# Altium schematic sheet GEM_AFE_128.SchDoc: Top
size 420 x 297 mm; CheckedBy: K.Belewicz; DrawnBy: G.Kasprowicz; SheetNumber: 1; SheetTotal: 5; ModifiedBy: -; CheckedDate: 12.06.2022; DivGrp: WUT ISE; Designer: G.Kasprowicz
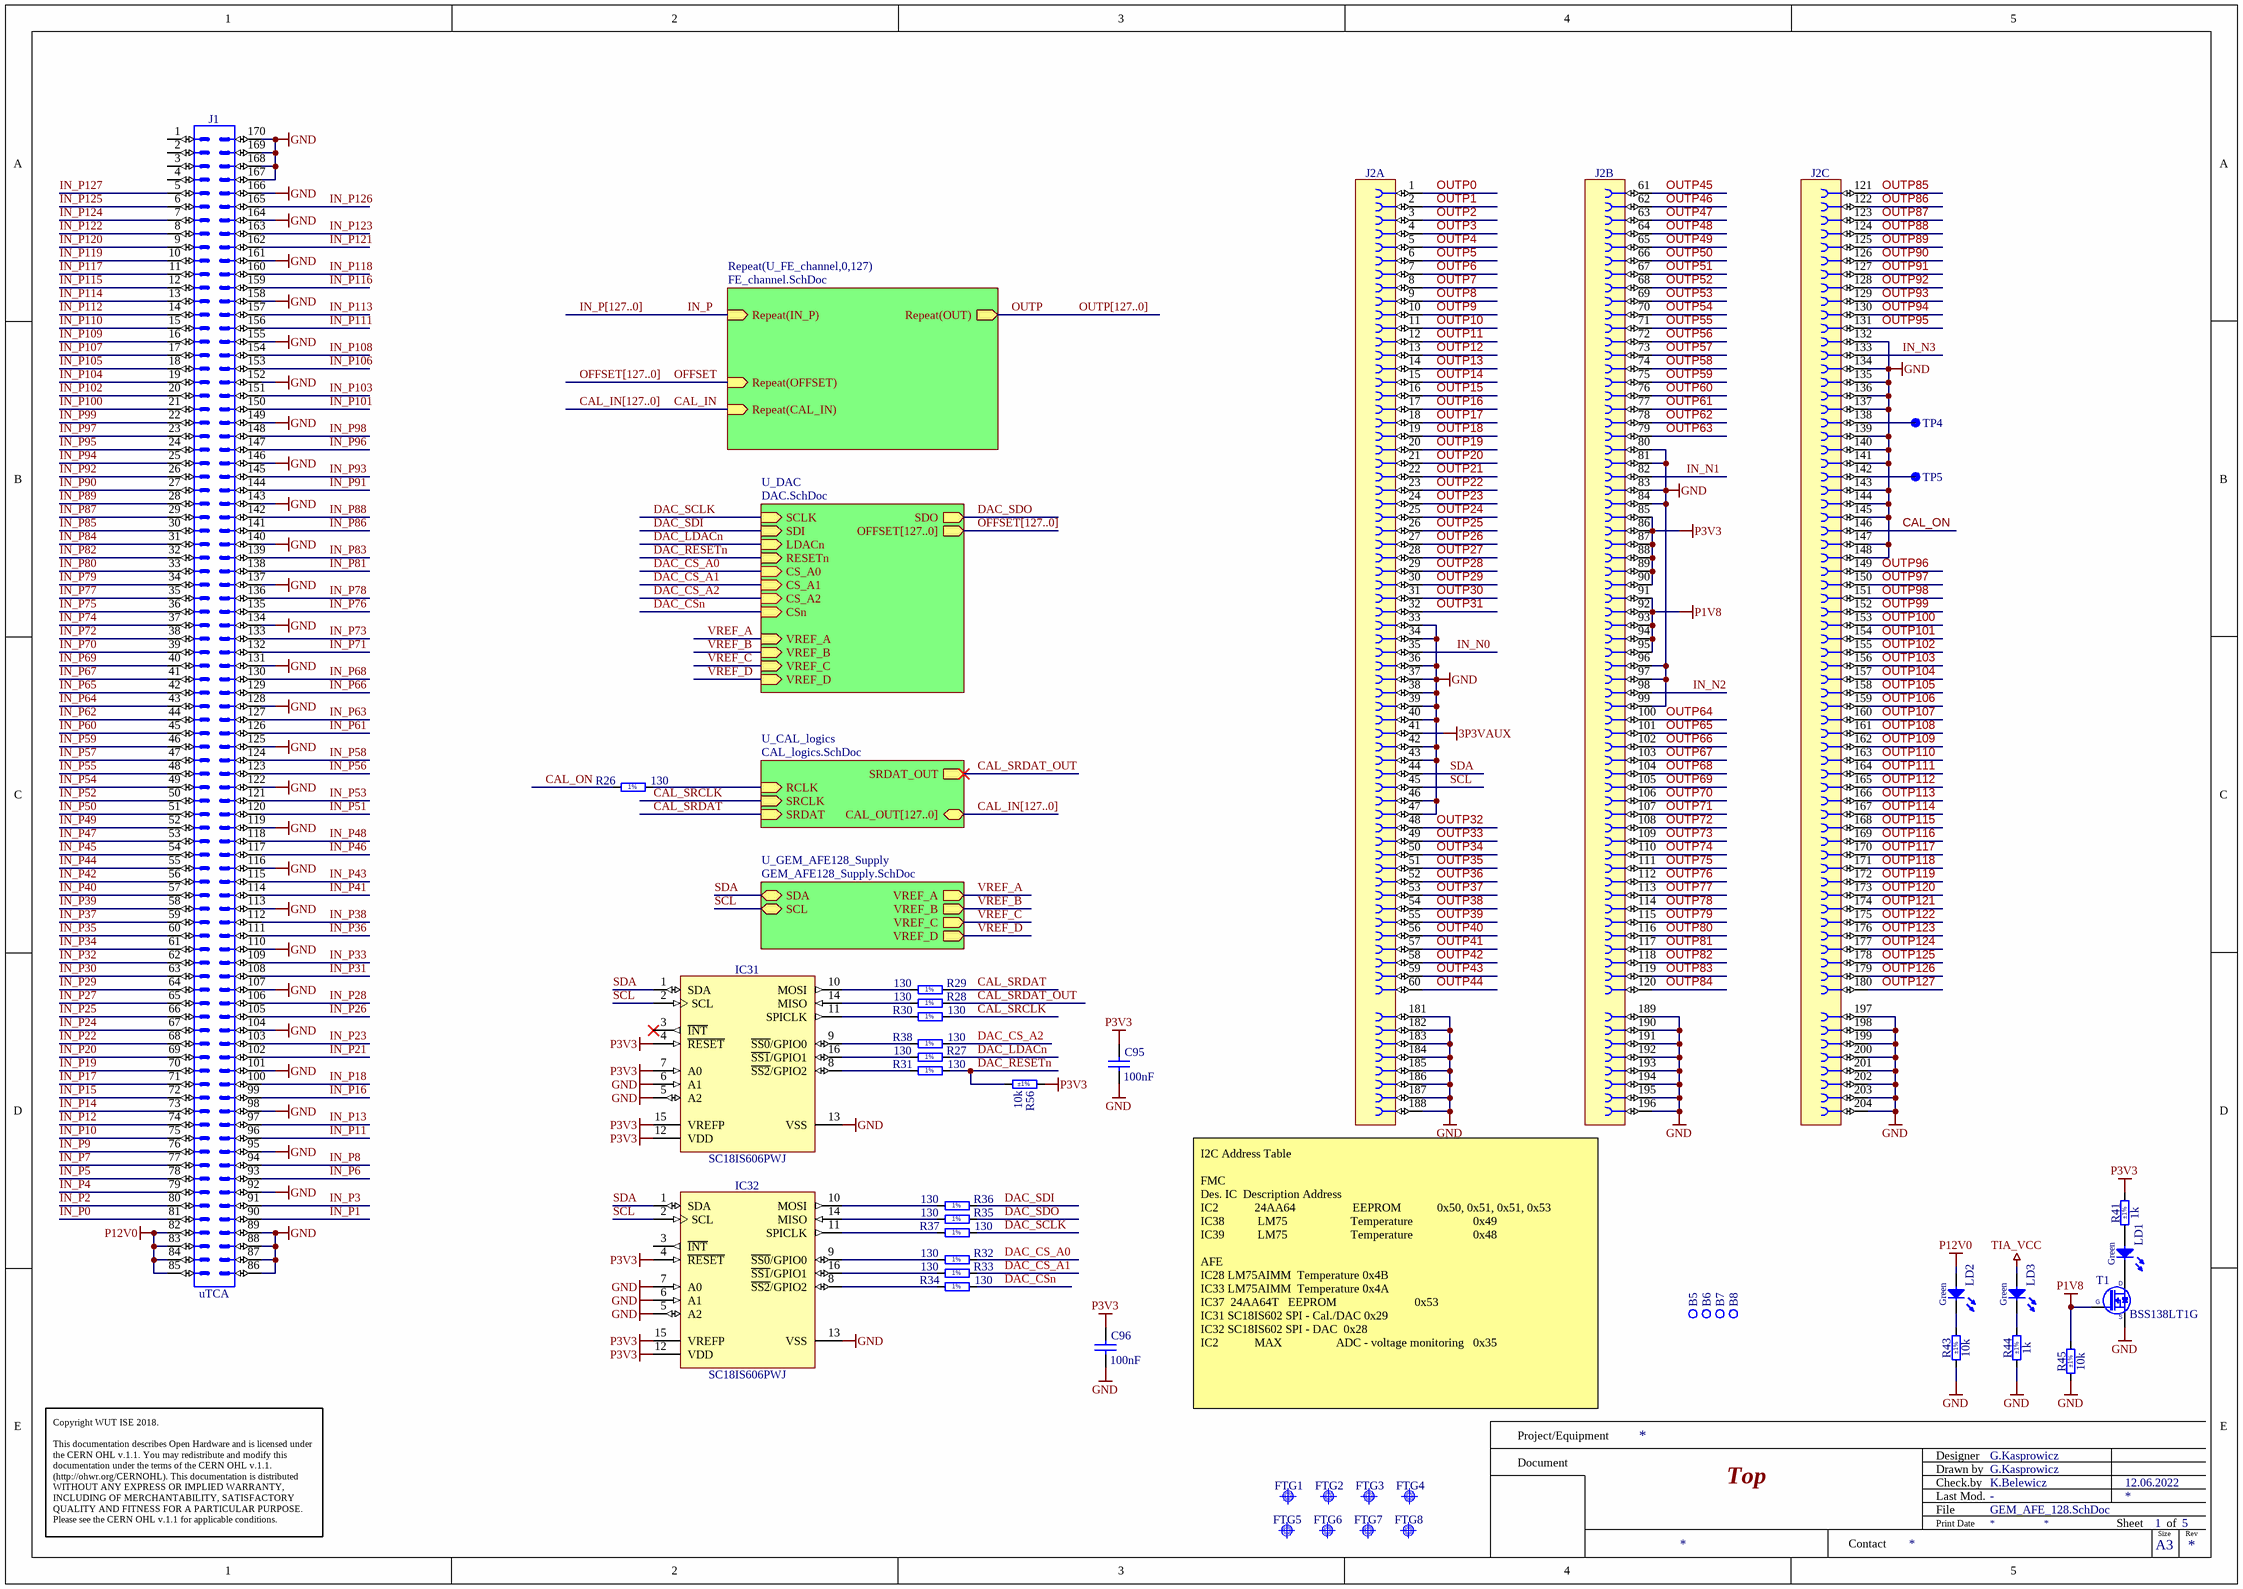
[diagram p0: GEM_AFE_128.SchDoc]

## Parts
B5  Plated Hole  [MTG320_550]  (value not drawn)  (no BOM)
B6  Plated Hole  [MTG320_550]  (value not drawn)  (no BOM)
B7  Plated Hole  [MTG320_550]  (value not drawn)  (no BOM)
B8  Plated Hole  [MTG320_550]  (value not drawn)  (no BOM)
C95  100nF  [CAPC1005X55N]
C96  100nF  [CAPC1005X55N]
FTG1  Use only in PCB  [FIDUCIAL_TOP_C100-200]  (value not drawn)
FTG2  Use only in PCB  [FIDUCIAL_TOP_C100-200]  (value not drawn)
FTG3  Use only in PCB  [FIDUCIAL_TOP_C100-200]  (value not drawn)
FTG4  Use only in PCB  [FIDUCIAL_TOP_C100-200]  (value not drawn)
FTG5  Use only in PCB  [FIDUCIAL_TOP_S100-200]  (value not drawn)
FTG6  Use only in PCB  [FIDUCIAL_TOP_S100-200]  (value not drawn)
FTG7  Use only in PCB  [FIDUCIAL_TOP_S100-200]  (value not drawn)
FTG8  Use only in PCB  [FIDUCIAL_TOP_S100-200]  (value not drawn)
IC31  SC18IS606PWJ  [SOP65P640X110-16N]
IC32  SC18IS606PWJ  [SOP65P640X110-16N]
J1  uTCA  [MICRO-TCA]
J2  (no value)  [SAMTEC_QSH-090-01-F-D-RA]  (parts A,B,C of 3)
LD1  Green  [LED_KINGBRIGHT_KPA-1606CGCK]
LD2  Green  [LED_KINGBRIGHT_KPA-1606CGCK]
LD3  Green  [LED_KINGBRIGHT_KPA-1606CGCK]
R26  130  [RESC1005X40N]
R27  130  [RESC1005X40N]
R28  130  [RESC1005X40N]
R29  130  [RESC1005X40N]
R30  130  [RESC1005X40N]
R31  130  [RESC1005X40N]
R32  130  [RESC1005X40N]
R33  130  [RESC1005X40N]
R34  130  [RESC1005X40N]
R35  130  [RESC1005X40N]
R36  130  [RESC1005X40N]
R37  130  [RESC1005X40N]
R38  130  [RESC1005X40N]
R41  1k  Tolerance: ±1%  [RESC1005X40N]
R43  10k  Tolerance: ±1%  [RESC1005X40N]
R44  1k  Tolerance: ±1%  [RESC1005X40N]
R45  10k  Tolerance: ±1%  [RESC1005X40N]
R56  10k  Tolerance: ±1%  [RESC1005X40N]
T1  BSS138LT1G  [SOT95P240X110-3N]
TP4  SMD Pad  [C100]  (value not drawn)
TP5  SMD Pad  [C100]  (value not drawn)

## Sub-sheets
Repeat(U_FE_channel,0,127) = FE_channel.SchDoc: Repeat(IN_P) (in), Repeat(OUT) (out), Repeat(CAL_IN) (in), Repeat(OFFSET) (in)
U_CAL_logics = CAL_logics.SchDoc: RCLK (in), SRCLK (in), SRDAT (in), SRDAT_OUT (out), CAL_OUT[127..0] (bidir)
U_DAC = DAC.SchDoc: SCLK (in), SDI (in), SDO (out), LDACn (in), RESETn (in), CS_A0 (in), CS_A1 (in), CS_A2 (in), CSn (in), OFFSET[127..0] (out), VREF_A (in), VREF_B (in), VREF_C (in), VREF_D (in)
U_GEM_AFE128_Supply = GEM_AFE128_Supply.SchDoc: SDA (bidir), SCL (bidir), VREF_A (out), VREF_B (out), VREF_C (out), VREF_D (out)

## Nets
3P3VAUX: J2.41
GND: C95.1 C96.1 IC31.5(A2) IC31.6(A1) IC31.13(VSS) IC32.5(A2) IC32.6(A1) IC32.7(A0) IC32.13(VSS) J1.86 J1.87 J1.88 J1.89 J1.92 J1.95 J1.98 J1.101 J1.104 J1.107 J1.110 J1.113 J1.116 J1.119 J1.122 J1.125 J1.128 J1.131 J1.134 J1.137 J1.140 J1.143 J1.146 J1.149 J1.152 J1.155 J1.158 J1.161 J1.164 J1.166 J1.167 J1.168 J1.169 J1.170 J2.33 J2.34 J2.36 J2.37 J2.38 J2.39 J2.40 J2.42 J2.43 J2.46 J2.47 J2.80 J2.81 J2.83 J2.84 J2.96 J2.97 J2.99 J2.132 J2.134 J2.135 J2.136 J2.137 J2.139 J2.140 J2.141 J2.143 J2.144 J2.145 J2.147 J2.148 J2.181 J2.182 J2.183 J2.184 J2.185 J2.186 J2.187 J2.188 J2.189 J2.190 J2.191 J2.192 J2.193 J2.194 J2.195 J2.196 J2.197 J2.198 J2.199 J2.200 J2.201 J2.202 J2.203 J2.204 R43.1 R44.1 R45.1 T1.2(S)
P1V8: J2.91 J2.92 J2.93 J2.94 J2.95 R45.2 T1.1(G)
P3V3: C95.2 C96.2 IC31.4(~{RESET}) IC31.7(A0) IC31.12(VDD) IC31.15(VREFP) IC32.4(~{RESET}) IC32.12(VDD) IC32.15(VREFP) J2.85 J2.86 J2.87 J2.88 J2.89 J2.90 R41.2 R56.2
P12V0: J1.82 J1.83 J1.84 J1.85 LD2.2(A)
TIA_VCC: LD3.2(A)
CAL_IN: sheet Repeat(U_FE_channel,0,127)/Repeat(CAL_IN)
CAL_ON: J2.146 R26.1
CAL_SRCLK: R30.2 ; sheet U_CAL_logics/SRCLK
CAL_SRDAT: R29.1 ; sheet U_CAL_logics/SRDAT
CAL_SRDAT_OUT: R28.1 ; sheet U_CAL_logics/SRDAT_OUT
DAC_CS_A0: R32.1 ; sheet U_DAC/CS_A0
DAC_CS_A1: R33.1 ; sheet U_DAC/CS_A1
DAC_CS_A2: R38.2 ; sheet U_DAC/CS_A2
DAC_CSn: R34.2 ; sheet U_DAC/CSn
DAC_LDACn: R27.1 ; sheet U_DAC/LDACn
DAC_RESETn: R31.2 R56.1 ; sheet U_DAC/RESETn
DAC_SCLK: R37.2 ; sheet U_DAC/SCLK
DAC_SDI: R36.1 ; sheet U_DAC/SDI
DAC_SDO: R35.1 ; sheet U_DAC/SDO
IN_N0: J2.35
IN_N1: J2.82
IN_N2: J2.98
IN_N3: J2.133
IN_P: sheet Repeat(U_FE_channel,0,127)/Repeat(IN_P)
IN_P0: J1.81
IN_P1: J1.90
IN_P2: J1.80
IN_P3: J1.91
IN_P4: J1.79
IN_P5: J1.78
IN_P6: J1.93
IN_P7: J1.77
IN_P8: J1.94
IN_P9: J1.76
IN_P10: J1.75
IN_P11: J1.96
IN_P12: J1.74
IN_P13: J1.97
IN_P14: J1.73
IN_P15: J1.72
IN_P16: J1.99
IN_P17: J1.71
IN_P18: J1.100
IN_P19: J1.70
IN_P20: J1.69
IN_P21: J1.102
IN_P22: J1.68
IN_P23: J1.103
IN_P24: J1.67
IN_P25: J1.66
IN_P26: J1.105
IN_P27: J1.65
IN_P28: J1.106
IN_P29: J1.64
IN_P30: J1.63
IN_P31: J1.108
IN_P32: J1.62
IN_P33: J1.109
IN_P34: J1.61
IN_P35: J1.60
IN_P36: J1.111
IN_P37: J1.59
IN_P38: J1.112
IN_P39: J1.58
IN_P40: J1.57
IN_P41: J1.114
IN_P42: J1.56
IN_P43: J1.115
IN_P44: J1.55
IN_P45: J1.54
IN_P46: J1.117
IN_P47: J1.53
IN_P48: J1.118
IN_P49: J1.52
IN_P50: J1.51
IN_P51: J1.120
IN_P52: J1.50
IN_P53: J1.121
IN_P54: J1.49
IN_P55: J1.48
IN_P56: J1.123
IN_P57: J1.47
IN_P58: J1.124
IN_P59: J1.46
IN_P60: J1.45
IN_P61: J1.126
IN_P62: J1.44
IN_P63: J1.127
IN_P64: J1.43
IN_P65: J1.42
IN_P66: J1.129
IN_P67: J1.41
IN_P68: J1.130
IN_P69: J1.40
IN_P70: J1.39
IN_P71: J1.132
IN_P72: J1.38
IN_P73: J1.133
IN_P74: J1.37
IN_P75: J1.36
IN_P76: J1.135
IN_P77: J1.35
IN_P78: J1.136
IN_P79: J1.34
IN_P80: J1.33
IN_P81: J1.138
IN_P82: J1.32
IN_P83: J1.139
IN_P84: J1.31
IN_P85: J1.30
IN_P86: J1.141
IN_P87: J1.29
IN_P88: J1.142
IN_P89: J1.28
IN_P90: J1.27
IN_P91: J1.144
IN_P92: J1.26
IN_P93: J1.145
IN_P94: J1.25
IN_P95: J1.24
IN_P96: J1.147
IN_P97: J1.23
IN_P98: J1.148
IN_P99: J1.22
IN_P100: J1.21
IN_P101: J1.150
IN_P102: J1.20
IN_P103: J1.151
IN_P104: J1.19
IN_P105: J1.18
IN_P106: J1.153
IN_P107: J1.17
IN_P108: J1.154
IN_P109: J1.16
IN_P110: J1.15
IN_P111: J1.156
IN_P112: J1.14
IN_P113: J1.157
IN_P114: J1.13
IN_P115: J1.12
IN_P116: J1.159
IN_P117: J1.11
IN_P118: J1.160
IN_P119: J1.10
IN_P120: J1.9
IN_P121: J1.162
IN_P122: J1.8
IN_P123: J1.163
IN_P124: J1.7
IN_P125: J1.6
IN_P126: J1.165
IN_P127: J1.5
OFFSET: sheet Repeat(U_FE_channel,0,127)/Repeat(OFFSET)
OUTP: sheet Repeat(U_FE_channel,0,127)/Repeat(OUT)
OUTP0: J2.1
OUTP1: J2.2
OUTP2: J2.3
OUTP3: J2.4
OUTP4: J2.5
OUTP5: J2.6
OUTP6: J2.7
OUTP7: J2.8
OUTP8: J2.9
OUTP9: J2.10
OUTP10: J2.11
OUTP11: J2.12
OUTP12: J2.13
OUTP13: J2.14
OUTP14: J2.15
OUTP15: J2.16
OUTP16: J2.17
OUTP17: J2.18
OUTP18: J2.19
OUTP19: J2.20
OUTP20: J2.21
OUTP21: J2.22
OUTP22: J2.23
OUTP23: J2.24
OUTP24: J2.25
OUTP25: J2.26
OUTP26: J2.27
OUTP27: J2.28
OUTP28: J2.29
OUTP29: J2.30
OUTP30: J2.31
OUTP31: J2.32
OUTP32: J2.48
OUTP33: J2.49
OUTP34: J2.50
OUTP35: J2.51
OUTP36: J2.52
OUTP37: J2.53
OUTP38: J2.54
OUTP39: J2.55
OUTP40: J2.56
OUTP41: J2.57
OUTP42: J2.58
OUTP43: J2.59
OUTP44: J2.60
OUTP45: J2.61
OUTP46: J2.62
OUTP47: J2.63
OUTP48: J2.64
OUTP49: J2.65
OUTP50: J2.66
OUTP51: J2.67
OUTP52: J2.68
OUTP53: J2.69
OUTP54: J2.70
OUTP55: J2.71
OUTP56: J2.72
OUTP57: J2.73
OUTP58: J2.74
OUTP59: J2.75
OUTP60: J2.76
OUTP61: J2.77
OUTP62: J2.78
OUTP63: J2.79
OUTP64: J2.100
OUTP65: J2.101
OUTP66: J2.102
OUTP67: J2.103
OUTP68: J2.104
OUTP69: J2.105
OUTP70: J2.106
OUTP71: J2.107
OUTP72: J2.108
OUTP73: J2.109
OUTP74: J2.110
OUTP75: J2.111
OUTP76: J2.112
OUTP77: J2.113
OUTP78: J2.114
OUTP79: J2.115
OUTP80: J2.116
OUTP81: J2.117
OUTP82: J2.118
OUTP83: J2.119
OUTP84: J2.120
OUTP85: J2.121
OUTP86: J2.122
OUTP87: J2.123
OUTP88: J2.124
OUTP89: J2.125
OUTP90: J2.126
OUTP91: J2.127
OUTP92: J2.128
OUTP93: J2.129
OUTP94: J2.130
OUTP95: J2.131
OUTP96: J2.149
OUTP97: J2.150
OUTP98: J2.151
OUTP99: J2.152
OUTP100: J2.153
OUTP101: J2.154
OUTP102: J2.155
OUTP103: J2.156
OUTP104: J2.157
OUTP105: J2.158
OUTP106: J2.159
OUTP107: J2.160
OUTP108: J2.161
OUTP109: J2.162
OUTP110: J2.163
OUTP111: J2.164
OUTP112: J2.165
OUTP113: J2.166
OUTP114: J2.167
OUTP115: J2.168
OUTP116: J2.169
OUTP117: J2.170
OUTP118: J2.171
OUTP119: J2.172
OUTP120: J2.173
OUTP121: J2.174
OUTP122: J2.175
OUTP123: J2.176
OUTP124: J2.177
OUTP125: J2.178
OUTP126: J2.179
OUTP127: J2.180
SCL: IC31.2(SCL) IC32.2(SCL) J2.45 ; sheet U_GEM_AFE128_Supply/SCL
SDA: IC31.1(SDA) IC32.1(SDA) J2.44 ; sheet U_GEM_AFE128_Supply/SDA
VREF_A: sheet U_DAC/VREF_A, sheet U_GEM_AFE128_Supply/VREF_A
VREF_B: sheet U_DAC/VREF_B, sheet U_GEM_AFE128_Supply/VREF_B
VREF_C: sheet U_DAC/VREF_C, sheet U_GEM_AFE128_Supply/VREF_C
VREF_D: sheet U_DAC/VREF_D, sheet U_GEM_AFE128_Supply/VREF_D
NetIC31_8: IC31.8(~{SS2}/GPIO2) R31.1
NetIC31_9: IC31.9(~{SS0}/GPIO0) R38.1
NetIC31_10: IC31.10(MOSI) R29.2
NetIC31_11: IC31.11(SPICLK) R30.1
NetIC31_14: IC31.14(MISO) R28.2
NetIC31_16: IC31.16(~{SS1}/GPIO1) R27.2
NetIC32_8: IC32.8(~{SS2}/GPIO2) R34.1
NetIC32_9: IC32.9(~{SS0}/GPIO0) R32.2
NetIC32_10: IC32.10(MOSI) R36.2
NetIC32_11: IC32.11(SPICLK) R37.1
NetIC32_14: IC32.14(MISO) R35.2
NetIC32_16: IC32.16(~{SS1}/GPIO1) R33.2
NetJ2_138: J2.138 TP4.1
NetJ2_142: J2.142 TP5.1
NetLD1_1: LD1.1(C) T1.3(D)
NetLD1_2: LD1.2(A) R41.1
NetLD2_1: LD2.1(C) R43.2
NetLD3_1: LD3.1(C) R44.2
NetR26_2: R26.2 ; sheet U_CAL_logics/RCLK

Not connected (* = marked no-connect by the designer): B5 1; B6 1; B7 1; B8 1; IC31 3(~{INT})*; IC32 3(~{INT}); J1 1 2 3 4

## Buses and harness runs
bus CAL_IN[127..0]
bus CAL_IN[127..0] = sheet U_CAL_logics/CAL_OUT[127..0]
bus IN_P[127..0]
bus OFFSET[127..0]
bus OFFSET[127..0] = sheet U_DAC/OFFSET[127..0]
bus OUTP[127..0]

## Notes on the sheet
- (near J2) I2C Address Table
  FMC
  Des.	IC		Description	Address
  IC2            24AA64                   EEPROM            0x50, 0x51, 0x51, 0x53
  IC38           LM75                     Temperature                    0x49
  IC39           LM75                     Temperature                    0x48
  AFE
  IC28	LM75AIMM 	Temperature	0x4B
  IC33	LM75AIMM 	Temperature	0x4A
  IC37 	24AA64T 		EEPROM       	                  0x53
  IC31	SC18IS602	SPI - Cal./DAC	0x29
  IC32	SC18IS602	SPI - DAC		0x28
  IC2            MAX                  ADC - voltage monitoring   0x35
- Project/Equipment
- Document
- Designer
- Drawn by
- Check.by
- Copyright WUT ISE 2018.
  This documentation describes Open Hardware and is licensed under the CERN OHL v.1.1. You may redistribute and modify this documentation under the terms of the CERN OHL v.1.1. (http://ohwr.org/CERNOHL). This documentation is distributed WITHOUT ANY EXPRESS OR IMPLIED WARRANTY, INCLUDING OF MERCHANTABILITY, SATISFACTORY QUALITY AND FITNESS FOR A PARTICULAR PURPOSE. Please see the CERN OHL v.1.1 for applicable conditions.
- Contact
- File
- Last Mod.
- Print Date
- Sheet
- Size
- A3
- of
- Rev
- (in symbol R0402_130R_1%_0.0625W_100PPM) 1%

## Library data of the parts
B5-B8 = PLATED_HOLE3.2_PAD5.5: Single Terminal Socket; Part Description: Plated Through Hole: Hole Dia.=3.2mm Pad Dia.=5.5mm; Mounted: No; Part Number: PLATED_HOLE3.2_PAD5.5; Component Type: Standard (No BOM); Pin Count: 1; Family: Plated Hole; Socket: No; SMD: No; Sense: No; Status: None; ComponentHeight: 0mm; HelpURL: Undefined; Author: CERN DEM JMW; CreateDate: 01.10.2012; LatestRevisionDate: 01.10.2012; PackageDescription: Plated Through Hole: Hole Dia.=3.2mm Pad Dia.=5.5mm
C95 C96 = CC0402_100NF_16V_10%_X7R: Non-polarised capacitor; Part Description: SMD Multilayer Chip Ceramic Capacitor; Manufacturer: GENERIC; Manufacturer1 Part Number: GRM155R71C104KA88D; Voltage: 16V; TC: X7R; Tolerance: ±10%; Table: Capacitors SMD; Part Number: CC0402_100NF_16V_10%_X7R; Component Kind: Standard; Component Type: Standard; Pin Count: 2; Value: 100nF; Status: Not Recommended; Manufacturer Part Number: CC0402_100NF_16V_10%_X7R; Case: 0402; Mounted: Yes; Socket: No; SMD: Yes; Manufacturer1 Example: MURATA; Manufacturer1 ComponentHeight: 0.55mm; HelpURL: \\cern.ch\dfs\Applications\Altium\Datasheets\CC0402_X7R_MURATA_GRM.pdf; Author: CERN DEM JLC; CreateDate: 2013-12-05; LatestRevisionDate: 2007-12-03
FTG1-FTG4 = FIDUCIAL_TARGET_C100-200: Fiducial Target; Part Description: Round Fiducial Target, Top Layer, 1.0mm, Top Solder 2.0mm, Keepout =2.0mm; Mounted: No; Table: Pads; Part Number: FIDUCIAL_TARGET_C100-200; Component Kind: Standard (No BOM); Component Type: Standard (No BOM); Pin Count: 1; Family: Fiducial; Socket: No; SMD: Yes; Status: None; ComponentHeight: 0mm; Author: CERN DEM JLC; CreateDate: 2010-02-09; LatestRevisionDate: 2012-04-04; PackageDescription: Round Fiducial Target, Top Layer, 1.0mm, Top Solder 2.0mm, Keepout =2.0mm
FTG5-FTG8 = FIDUCIAL_TARGET_S100-200: Fiducial Target; Part Description: Square Fiducial Target, Top Layer, 1.0mm, Top Solder 2.0mm, Keepout =2.0mm; Mounted: No; Table: Pads; Part Number: FIDUCIAL_TARGET_S100-200; Component Kind: Standard (No BOM); Component Type: Standard (No BOM); Pin Count: 1; Family: Fiducial; Socket: No; SMD: Yes; Status: None; ComponentHeight: 0mm; Author: CERN DEM JLC; CreateDate: 2010-02-09; LatestRevisionDate: 2012-04-04; PackageDescription: Square Fiducial Target, Top Layer, 1.0mm, Top Solder 2.0mm, Keepout =2.0mm
IC31 IC32 = SC18IS606PWJ: I2C-bus to SPI bridge; Manufacturer: NXP SEMICONDUCTORS; PressFit: No; Bonding: No; Part Number: SC18IS606PWJ; Component Kind: Standard; Component Type: Standard; Device: SC18IS606PWJ; PackageDescription: SOP, 0.65mm pitch; 16 pin, 4.40mm W X 5.00mm L X 1.10mm H body IPC Medium Density; Part Description: I2C-Bus to SPI Bridge; Manufacturer Part Number: SC18IS606PWJ; Pin Count: 16; Case: TSSOP16; Mounted: Yes; Socket: No; SMD: Yes; Sense: No; ComponentHeight: 1.1mm; HelpURL: \\cern.ch\dfs\Applications\Altium\Datasheets\SC18IS602B.pdf; Author: GK; CreateDate: 14/12/2015; LatestRevisionDate: 14/12/2015
J1 = PICMG_uTCA.0_R1.0.: 170 Contact MicroTCA (Telecom Computing Architecture) Board Edge Connector; Manufacturer: PICMG; Mounted: No; PressFit: No; Part Number: PICMG_uTCA.0_R1.0.; Component Kind: Standard (No BOM); Component Type: Standard (No BOM); Pin Count: 170; Family: uTCA; Socket: No; SMD: No; Sense: No; Status: None; Part Description: 170 Contact MicroTCA (Telecom Computing Architecture) Board Edge Connector; ComponentHeight: 0mm; HelpURL: \\cern.ch\dfs\Applications\Altium\Datasheets\PICMG_uTCA.0_R1.0.pdf; Author: CERN DEM JLC; CreateDate: 27.01.2015; LatestRevisionDate: 27.01.2015
J2 = SAMTEC_QSH-090-01-F-D-RA: Connector 180 Female (3x60) + 3x8 GND; Part Description: 180 Contacts ((2X30)x3), Pitch 0.5mm, RIGHT-ANGLE Double Row High Speed Ground Plane Socket; Manufacturer: SAMTEC; PressFit: No; Part Number: SAMTEC_QSH-090-01-F-D-RA; Component Kind: Standard; Component Type: Standard; Pin Count: 204; Mounted: Yes; Socket: No; SMD: Yes; Sense: No; Status: None; Manufacturer Part Number: QSH-090-01-F-D-RA; ComponentHeight: 15.5mm; HelpURL: \\cern.ch\dfs\Applications\Altium\Datasheets\SAMTEC_QSH-090-01-F-D-RA.pdf; Author: CERN DEM HF; CreateDate: 14.04.2022; LatestRevisionDate: 14.04.2022
LD1-LD3 = LED_KINGBRIGHT_KPA-1606CGCK: LED Green 1C 2A; Part Description: SMD Green LED, Right Angle Mount, Body L 1.6 x W 0.6mm, 1.2mm Thickness; PressFit: No; Bonding: No; Part Number: LED_KINGBRIGHT_KPA-1606CGCK; Component Kind: Standard; Component Type: Standard; Color: Green; PackageDescription: SMT Green LED, Right Angle Mount, Body L 1.6 x W 0.6mm H 1.2mm; Status: Not Recommended; Manufacturer: KINGBRIGHT; Manufacturer Part Number: KPA-1606CGCK; Pin Count: 2; Case: 0603; Mounted: Yes; Socket: No; SMD: Yes; Sense: No; ComponentHeight: 1.2mm; HelpURL: \\cern.ch\dfs\Applications\Altium\Datasheets\LED_KINGBRIGHT_KPA-1606CGCK.pdf; Author: CERN DEM MR; CreateDate: 18.12.2017; LatestRevisionDate: 18.12.2017
R26-R38 = R0402_130R_1%_0.0625W_100PPM: Resistor - 1%; Part Description: General Purpose Thick Film Chip Resistor; Manufacturer: GENERIC; Manufacturer1 Part Number: 232270671301L; TC: ±100ppm/°C; Table: Resistors SMD; Part Number: R0402_130R_1%_0.0625W_100PPM; Component Kind: Standard; Component Type: Standard; Pin Count: 2; Value: 130; Status: Not recommended; Power: 0.0625W; Tolerance: ±1%; Manufacturer Part Number: R0402_130R_1%_0.0625W_100PPM; Case: 0402; Mounted: Yes; Socket: No; SMD: Yes; Manufacturer1 Example: YAGEO PHYCOMP; Manufacturer1 ComponentHeight: 0.4mm; HelpURL: \\cern.ch\dfs\Applications\Altium\Datasheets\R0402_Phycomp_RC0402.pdf; Author: CERN DEM JLC; CreateDate: 2007-12-03; LatestRevisionDate: 2012-10-17
R41 R44 = R0402_1K_1%_0.0625W_100PPM: Resistor - 1%; Part Description: General Purpose Thick Film Chip Resistor; Manufacturer: GENERIC; Manufacturer1 Part Number: 232270671002L; TC: ±100ppm/°C; PressFit: No; Part Number: R0402_1K_1%_0.0625W_100PPM; Component Kind: Standard; Component Type: Standard; Pin Count: 2; Value: 1k; Status: Not Recommended; Power: 0.0625W; Manufacturer Part Number: R0402_1K_1%_0.0625W_100PPM; Case: 0402; Mounted: Yes; Sense: No; Socket: No; SMD: Yes; Manufacturer1 Example: YAGEO PHYCOMP; Manufacturer1 ComponentHeight: 0.4mm; HelpURL: \\cern.ch\dfs\Applications\Altium\Datasheets\R0402_Phycomp_RC0402.pdf; Author: CERN DEM JLC; CreateDate: 03.12.2007; LatestRevisionDate: 17.10.2012
R43 R45 R56 = R0402_10K_1%_0.0625W_100PPM: Resistor - 1%; Part Description: General Purpose Thick Film Chip Resistor; Manufacturer: GENERIC; Manufacturer1 Part Number: 232270671003L; TC: ±100ppm/°C; PressFit: No; Part Number: R0402_10K_1%_0.0625W_100PPM; Component Kind: Standard; Component Type: Standard; Pin Count: 2; Value: 10k; Status: Not Recommended; Power: 0.0625W; Manufacturer Part Number: R0402_10K_1%_0.0625W_100PPM; Case: 0402; Mounted: Yes; Sense: No; Socket: No; SMD: Yes; Manufacturer1 Example: YAGEO PHYCOMP; Manufacturer1 ComponentHeight: 0.4mm; HelpURL: \\cern.ch\dfs\Applications\Altium\Datasheets\R0402_Phycomp_RC0402.pdf; Author: CERN DEM JLC; CreateDate: 03.12.2007; LatestRevisionDate: 17.10.2012
T1 = BSS138LT1G: N-CHANNEL MOSFET WITH DIODE; Part Description: 50V, 200mA N-Channel Enhancement Mode Field-Effect Transistor; Manufacturer: ON SEMICONDUCTOR; PressFit: No; Bonding: No; Part Number: BSS138LT1G; Component Kind: Standard; Component Type: Standard; Device: BSS138LT1G; PackageDescription: SOT23, 0.95mm Pitch; 3 Pin, 1.40mm W X 3.00mm L X 1.10mm H body, IPC Medium Density; Manufacturer Part Number: BSS138L; Pin Count: 3; Case: SOT23-3; Mounted: Yes; Socket: No; SMD: Yes; Sense: No; ComponentHeight: 1.11mm; HelpURL: \\cern.ch\dfs\Applications\Altium\Datasheets\BSS138LT1G.pdf; Author: CERN DEM JLC; CreateDate: 23.03.2009; LatestRevisionDate: 25.05.2022
TP4 TP5 = SMD_PAD_D1MM: Pad; Part Description: 1mm Diameter SMD Pad; Mounted: No; Part Number: SMD_PAD_D1MM; Component Kind: Standard (No BOM); Component Type: Standard (No BOM); Pin Count: 1; Family: SMD Pad; Socket: No; SMD: Yes; Sense: No; Status: None; ComponentHeight: 0mm; HelpURL: Undefined; Author: CERN DEM JLC; CreateDate: 10.10.2017; LatestRevisionDate: 10.10.2017; PackageDescription: 1mm Diameter SMD Pad